# EasyEDA Pro project RBCTL1V2_V1.3.eprj, schematic ctl1v2sch
Board Name: Board1ctl1v2; Create Date: 2024-11-13; Page Name: P1; Project Name: RBCTL1V2; Schematic Name: ctl1v2sch; Update Date: 2024-11-17; Company: 嘉立创EDA; Page Size: A4; Version: V1.0
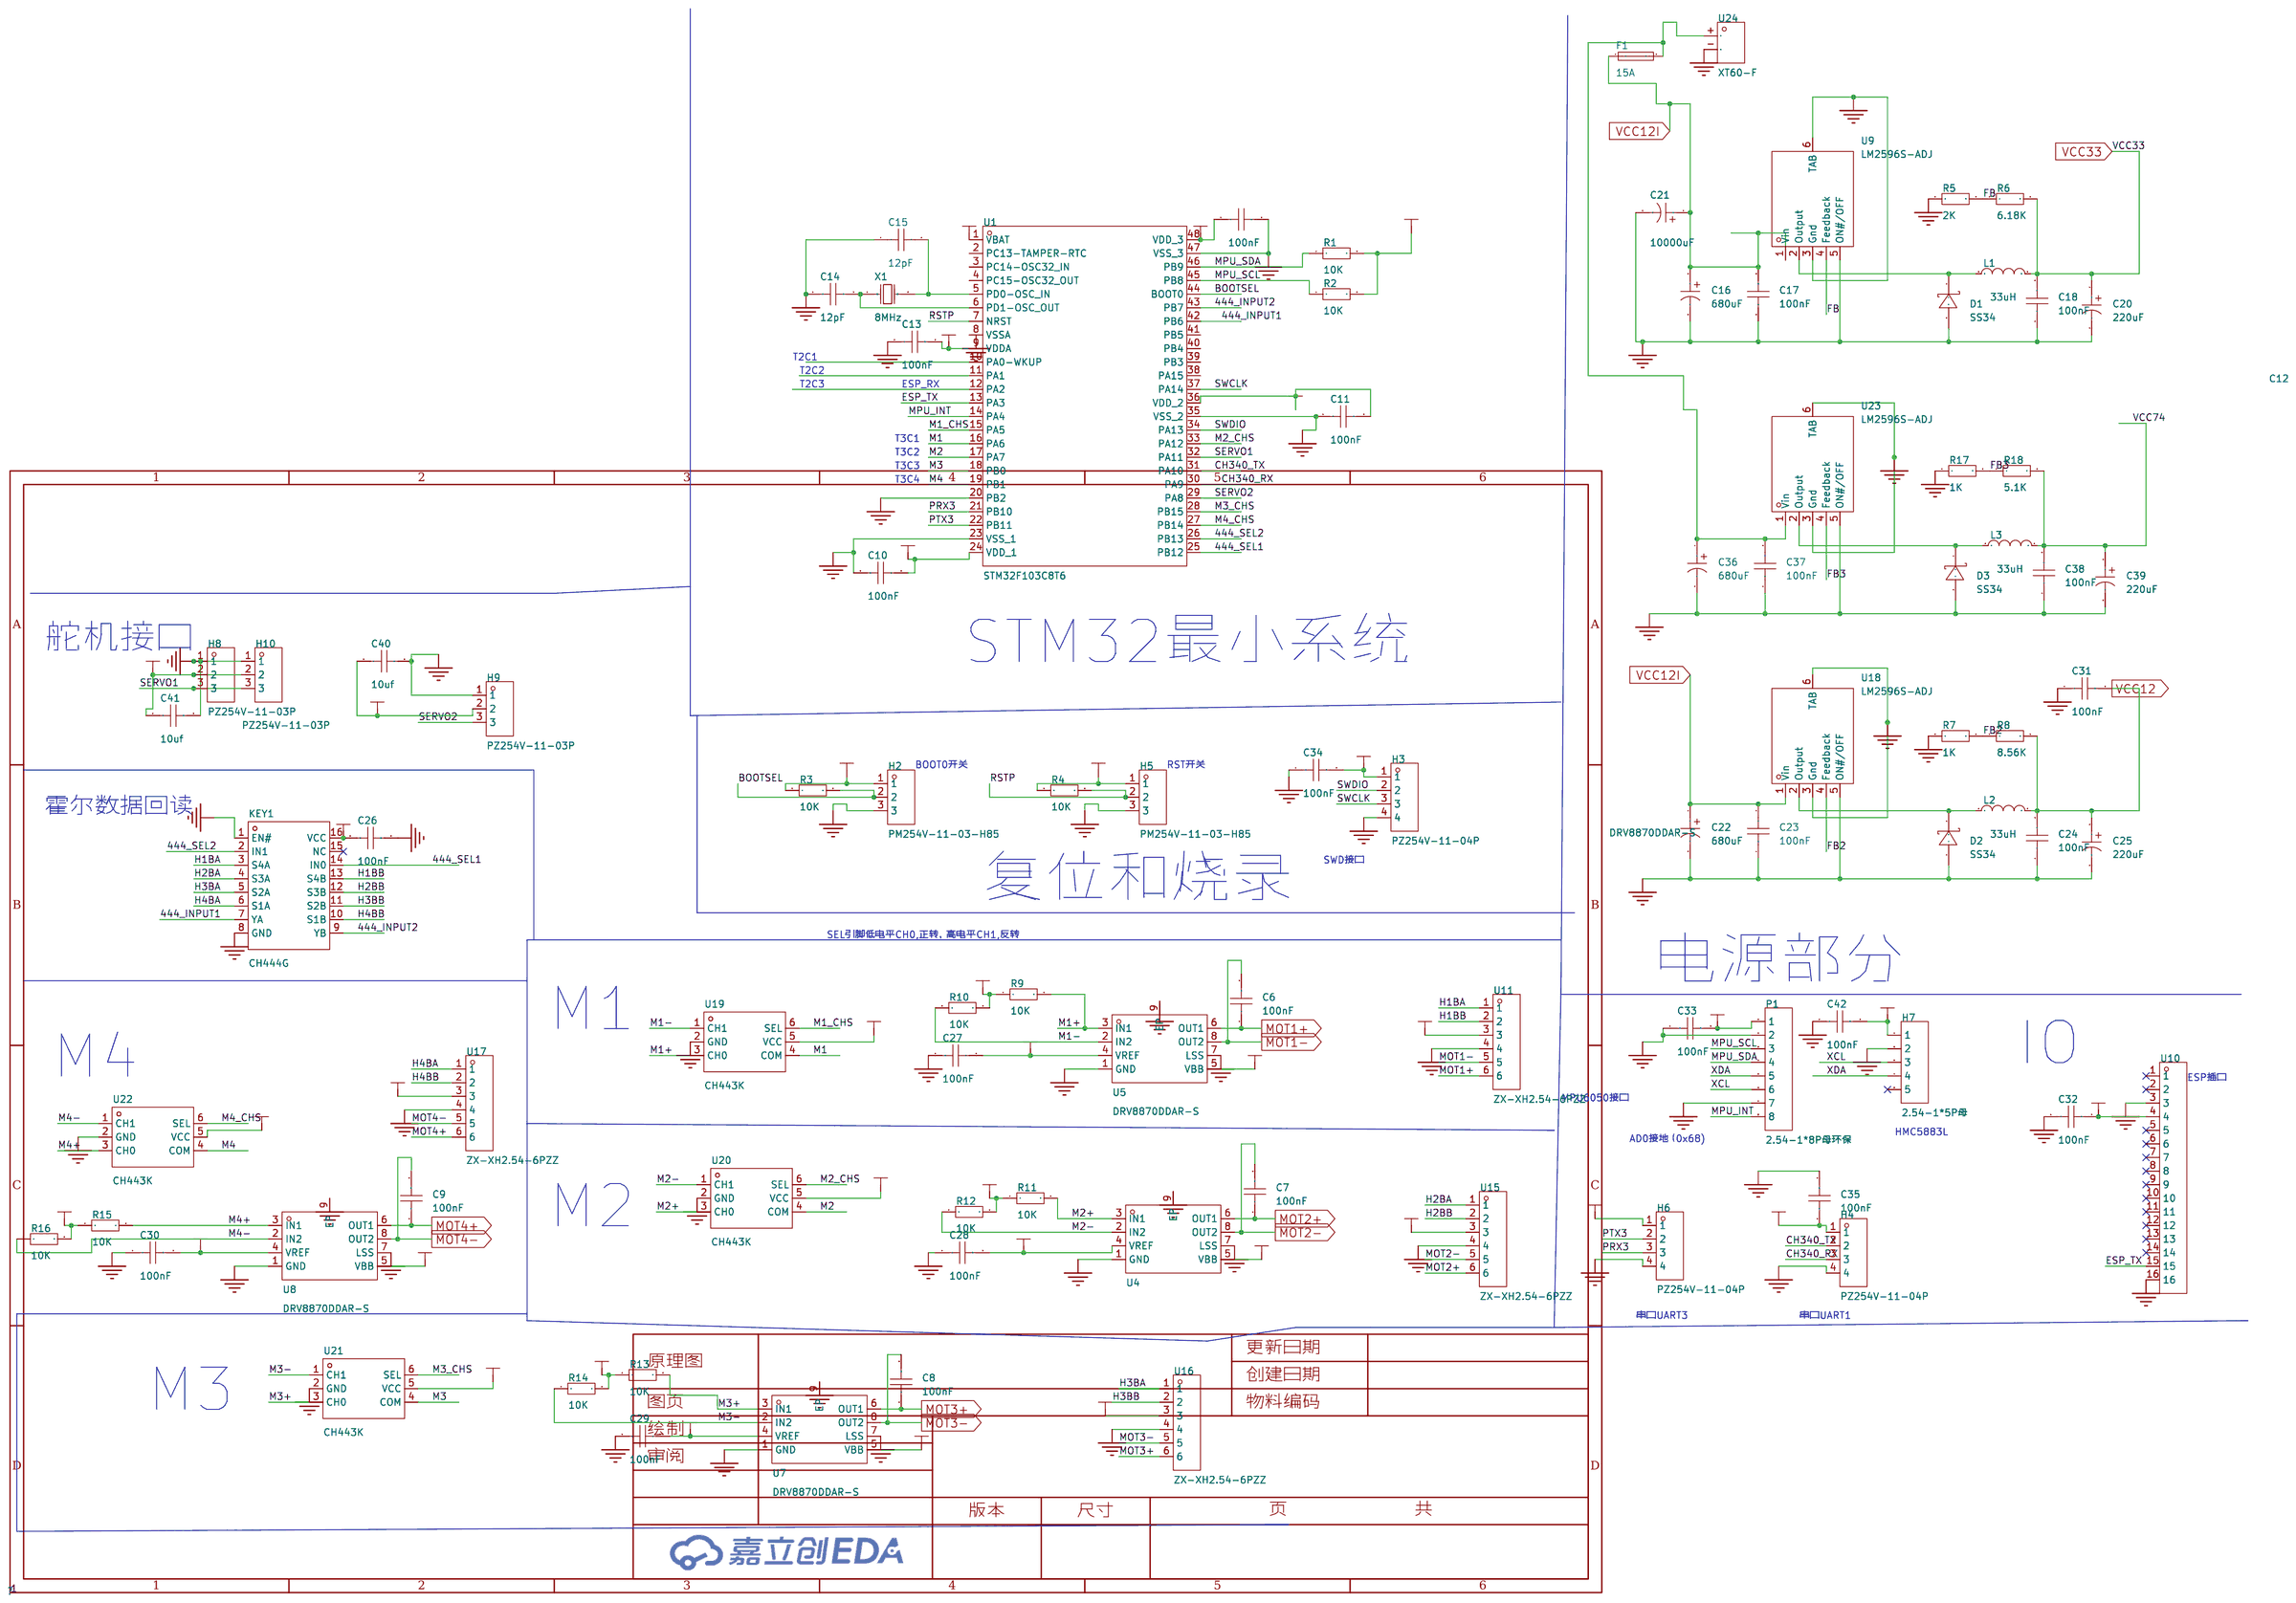
[diagram p0: schematic sheet]

## Parts
C6  100nF  [C0603]
C7  100nF  [C0603]
C8  100nF  [C0603]
C9  100nF  [C0603]
C10  100nF  [C0603]
C11  100nF  [C0603]
C12  100nF  [C0603]
C13  100nF  [C0603]
C14  12pF  [C0603]
C15  12pF  [C0603]
C16  680uF  [CAP-SMD_BD10.0-L10.3-W10.3-LS10.9-FD]
C17  100nF  [C0603]
C18  100nF  [C0603]
C20  220uF  [CAP-SMD_BD10.0-L10.3-W10.3-LS10.9-FD]
C21  10000uF  [CAP-TH_BD18.0-P7.50-D0.8-FD]
C22  680uF  [CAP-SMD_BD10.0-L10.3-W10.3-LS10.9-FD]
C23  100nF  [C0603]
C24  100nF  [C0603]
C25  220uF  [CAP-SMD_BD10.0-L10.3-W10.3-LS10.9-FD]
C26  100nF  [C0603]
C27  100nF  [C0603]
C28  100nF  [C0603]
C29  100nF  [C0603]
C30  100nF  [C0603]
C31  100nF  [C0603]
C32  100nF  [C0603]
C33  100nF  [C0603]
C34  100nF  [C0603]
C35  100nF  [C0603]
C36  680uF  [CAP-TH_BD10.0-P5.00-D0.6-FD]
C37  100nF  [C1206]
C38  100nF  [C0603]
C39  220uF  [CAP-SMD_BD10.0-L10.3-W10.3-LS10.9-FD]
C40  10uf  [C0603]
C41  10uf  [C0603]
C42  100nF  [C0603]
D1  SS34  [SMA_L4.3-W2.6-LS5.2-RD]
D2  SS34  [SMA_L4.3-W2.6-LS5.2-RD]
D3  SS34  [SMA_L4.3-W2.6-LS5.2-RD]
F1  15A  [F1812]
H2  PM254V-11-03-H85  [HDR-TH_3P-P2.54-V-F]
H3  PZ254V-11-04P  [HDR-TH_4P-P2.54-V-M]
H4  PZ254V-11-04P  [HDR-TH_4P-P2.54-V-M]
H5  PM254V-11-03-H85  [HDR-TH_3P-P2.54-V-F]
H6  PZ254V-11-04P  [HDR-TH_4P-P2.54-V-M]
H7  2.54-1*5P母  [HDR-TH_5P-P2.54-V-F]
H8  PZ254V-11-03P  [HDR-TH_3P-P2.54-V-M]
H9  PZ254V-11-03P  [HDR-TH_3P-P2.54-V-M]
H10  PZ254V-11-03P  [HDR-TH_3P-P2.54-V-M]
KEY1  CH444G  [SOP-16_L10.0-W3.9-P1.27-LS6.0-BL]
L1  33uH  [IND-SMD_L7.0-W6.6_FXL0630]
L2  33uH  [IND-SMD_L7.0-W6.6_FXL0630]
L3  33uH  [IND-SMD_L7.0-W6.6_FXL0630]
P1  2.54-1*8P母环保  [HDR-TH_8P-P2.54-V-F-1]
R1  10K  [R0805]
R2  10K  [R0805]
R3  10K  [R0805]
R4  10K  [R0805]
R5  2K  [R0603]
R6  6.18K  [R0603]
R7  1K  [R0603]
R8  8.56K  [R0603]
R9  10K  [R0603]
R10  10K  [R0603]
R11  10K  [R0603]
R12  10K  [R0603]
R13  10K  [R0603]
R14  10K  [R0603]
R15  10K  [R0603]
R16  10K  [R0603]
R17  1K  [R0603]
R18  5.1K  [R0603]
U1  STM32F103C8T6  [LQFP-48_L7.0-W7.0-P0.50-LS9.0-BL]
U4  DRV8870DDAR-S  [SOP-8_L4.9-W3.9-P1.27-LS6.0-BL-EP3.3-2]
U5  DRV8870DDAR-S  [SOP-8_L4.9-W3.9-P1.27-LS6.0-BL-EP3.3-2]
U7  DRV8870DDAR-S  [SOP-8_L4.9-W3.9-P1.27-LS6.0-BL-EP3.3-2]
U8  DRV8870DDAR-S  [SOP-8_L4.9-W3.9-P1.27-LS6.0-BL-EP3.3-2]
U9  LM2596S-ADJ  [TO-263-5_L10.2-W8.6-P1.70-LS14.4-BL]
U10  PM254-1-16-Z-8.5  [HDR-TH_16P-P2.54-V-F-A]
U11  ZX-XH2.54-6PZZ  [CONN-TH_6P-P2.50_ZX-XH2.54-6PZZ]
U15  ZX-XH2.54-6PZZ  [CONN-TH_6P-P2.50_ZX-XH2.54-6PZZ]
U16  ZX-XH2.54-6PZZ  [CONN-TH_6P-P2.50_ZX-XH2.54-6PZZ]
U17  ZX-XH2.54-6PZZ  [CONN-TH_6P-P2.50_ZX-XH2.54-6PZZ]
U18  LM2596S-ADJ  [TO-263-5_L10.2-W8.6-P1.70-LS14.4-BL]
U19  CH443K  [SC70-6_L2.1-W1.3-P0.65-LS2.3-BL]
U20  CH443K  [SC70-6_L2.1-W1.3-P0.65-LS2.3-BL]
U21  CH443K  [SC70-6_L2.1-W1.3-P0.65-LS2.3-BL]
U22  CH443K  [SC70-6_L2.1-W1.3-P0.65-LS2.3-BL]
U23  LM2596S-ADJ  [TO-263-5_L10.2-W8.6-P1.70-LS14.4-BL]
U24  XT60-F  [CONN-TH_XT60PB-F]
X1  8MHz  [CRYSTAL-SMD_L11.5-W4.8-LS12.7]

## Library data of the parts
C6-C15 C17 C18 C23 C24 C26-C35 C38 C40-C42 = CAP_0603: Supplier Footprint: 0603
C16 C22 = GVM1V681M1010: LCSC Part Name: 680uF ±20% 35V; Supplier Part: C2980172; Manufacturer: HONOR(荣誉); Supplier Footprint: SMD,D12.5xL13.5mm; JLCPCB Part Class: 扩展库; Datasheet: https://atta.szlcsc.com/upload/public/pdf/source/20220509/EB2A569F0F3393644DE07704993C28AA.pdf; Supplier: LCSC; Tolerance: ±20%; Rated Voltage: 35V; Ripple Current: 1.19A@120Hz; Equivalent Series Resistance(ESR): 60mΩ@120Hz; φD: 10mm; L: 10.2mm; Lifetime @ Temp: 5000hrs@105℃; Operating Temperature: -55℃~+105℃
C20 C25 C39 = GVM1V681M1010: LCSC Part Name: 680uF ±20% 35V; Supplier Part: C2980172; Manufacturer: HONOR(荣誉); Supplier Footprint: SMD,D10xL10.5mm; JLCPCB Part Class: 扩展库; Datasheet: https://atta.szlcsc.com/upload/public/pdf/source/20220509/EB2A569F0F3393644DE07704993C28AA.pdf; Supplier: LCSC; Tolerance: ±20%; Rated Voltage: 35V; Ripple Current: 1.19A@120Hz; Equivalent Series Resistance(ESR): 60mΩ@120Hz; φD: 10mm; L: 10.2mm; Lifetime @ Temp: 5000hrs@105℃; Operating Temperature: -55℃~+105℃
C21 = ERE1EM103M40OT: LCSC Part Name: 10000uF ±20% 25V; Supplier Part: C724478; Manufacturer: AISHI(艾华集团); Supplier Footprint: 插件,D18xL40mm; JLCPCB Part Class: 扩展库; Datasheet: https://atta.szlcsc.com/upload/public/pdf/source/20190702/C401559_D116D2C5ED42D458EC9986A0749FDD04.pdf; Supplier: LCSC; Tolerance: ±20%; Rated Voltage: 25V
C36 = ERS1VM681G16OT: LCSC Part Name: 680uF ±20% 35V; Supplier Part: C721283; Manufacturer: AISHI(艾华集团); Supplier Footprint: 插件,D10xL16mm; JLCPCB Part Class: 扩展库; Datasheet: https://atta.szlcsc.com/upload/public/pdf/source/20191015/C438940_4B8E60A742BB0AE40DDEF87A5C89089D.pdf; Supplier: LCSC; Tolerance: ±20%; Rated Voltage: 35V
C37 = CAP_1206: Supplier Footprint: 1206
D1-D3 = SS34_C8678: LCSC Part Name: 电压:40V 电流:3A; Supplier Part: C8678; Manufacturer: MDD(辰达半导体); Supplier Footprint: SMA(DO-214AC); Datasheet: https://atta.szlcsc.com/upload/public/pdf/source/20240710/2118BB86FDDB2E0B294389AC1F3F65C8.pdf; Supplier: LCSC; Diode Configuration: 独立式; Forward Voltage (Vf@If): 550mV@3A; Reverse Voltage (Vr): 40V; Rectified Current: 3A; Reverse Leakage Current (Ir): 500uA@40V
F1 = JK-MSMD050-30: LCSC Part Name: 贴片保险丝 1812 0.5A 30V 自恢复保险丝; Supplier Part: C369168; Manufacturer: JK(金科); Supplier Footprint: 1812; JLCPCB Part Class: Extended Part; Datasheet: https://atta.szlcsc.com/upload/public/pdf/source/20190306/C369168_666AD8DA49E842FD6D0EBD7C2E7BAC74.pdf; Supplier: LCSC; Operating Voltage (Max): 30V; Current Rating (Max): 100A; Hold Current: 500mA; Trip Current: 1A; Maximum Time to Trip: 150ms
H2 H5 = PM254V-11-03-H85: LCSC Part Name: 间距:2.54mm 1x3P 直插; Supplier Part: C541850; Manufacturer: XFCN(兴飞); Supplier Footprint: 插件,P=2.54mm; JLCPCB Part Class: 扩展库; Datasheet: https://atta.szlcsc.com/upload/public/pdf/source/20200518/C541849_85853D71FC67C51915A806977A588FDA.pdf; Supplier: LCSC; Holes Structure: 1x3P; Pitch: 2.54mm; Mounting Type: 直插; Number of Rows: 单排; Number of Holes: 3P; Contact Material: 黄铜
H3 H4 H6 = PZ254V-11-04P: LCSC Part Name: 间距:2.54mm 1x4P 直插 方针; Supplier Part: C2691448; Manufacturer: XFCN(兴飞); Supplier Footprint: 插件,P=2.54mm; JLCPCB Part Class: 扩展库; Datasheet: https://atta.szlcsc.com/upload/public/pdf/source/20200309/C492403_F9F19131791D08044AD4F84F8E751A34.pdf; Supplier: LCSC; Pin Structure: 1x4P; Pitch: 2.54mm; Circluar Pins/Square Pins: 方针; Mounting Type: 直插; Number of Rows: 单排; Number of Pins: 4P; Current Rating (Max): 3A; Voltage Rating (Max): 250V; Length of Mating Pin: 6mm; Insulation Height: 2.5mm; Length of End Connection Pin: 3mm; Operating Temperature Range: -40℃~+105℃; Color: 黑色
H7 = 2.54-1*5P母: LCSC Part Name: 间距:2.54mm 1x5P 直插; Supplier Part: C50950; Manufacturer: BOOMELE(博穆精密); Supplier Footprint: 插件,P=2.54mm; JLCPCB Part Class: 扩展库; Datasheet: https://atta.szlcsc.com/upload/public/pdf/source/20210301/C2718488_F4427B881E42CAA8DDB0B1C12B3A522C.pdf; Supplier: LCSC; Holes Structure: 1x5P; Pitch: 2.54mm; Mounting Type: 直插; Number of Rows: 单排; Number of Holes: 5P
H8-H10 = PZ254V-11-03P: LCSC Part Name: 间距:2.54mm 1x3P 直插 方针; Supplier Part: C2937625; Manufacturer: XFCN(兴飞); Supplier Footprint: 插件,P=2.54mm; JLCPCB Part Class: 扩展库; Datasheet: https://atta.szlcsc.com/upload/public/pdf/source/20200309/C492402_8335C3D49C4E4C618838D59BB1D024C1.pdf; Supplier: LCSC; Pin Structure: 1x3P; Pitch: 2.54mm; Circluar Pins/Square Pins: 方针; Mounting Type: 直插; Number of Rows: 单排; Number of Pins: 3P; Current Rating (Max): 3A; Voltage Rating (Max): 250V; Length of Mating Pin: 6mm; Insulation Height: 2.5mm; Length of End Connection Pin: 3mm; Operating Temperature Range: -40℃~+105℃; Color: 黑色
KEY1 = CH444G: Supplier Part: C86413; Manufacturer: WCH(南京沁恒); Supplier Footprint: SOP-16; JLCPCB Part Class: 扩展库; Datasheet: https://atta.szlcsc.com/upload/public/pdf/source/20200819/C86413_4A848764FF9BBB5607D598F0D5C44A3B.pdf; Supplier: LCSC
L1-L3 = FXL0630-470-M: LCSC Part Name: 47uH ±20% 2A; Supplier Part: C475913; Manufacturer: cjiang(长江微电); Supplier Footprint: SMD,6.6x7mm; JLCPCB Part Class: 扩展库; Datasheet: https://atta.szlcsc.com/upload/public/pdf/source/20240426/3189EA8206330E2108542F9E34E540E7.pdf; Supplier: LCSC; Tolerance: ±20%; Rated Current: 1.5A; Saturation Current (Isat): 2A; DC Resistance (DCR): 385mΩ; Type: 一体成型电感
P1 = 2.54-1*8P母环保: LCSC Part Name: 间距:2.54mm 1x8P 直插; Supplier Part: C27438; Manufacturer: BOOMELE(博穆精密); Supplier Footprint: 插件,P=2.54mm; JLCPCB Part Class: 扩展库; Datasheet: https://atta.szlcsc.com/upload/public/pdf/source/20231221/1CA800C6799ED97958773716FAA1BFFE.pdf; Supplier: LCSC; Holes Structure: 1x8P; Pitch: 2.54mm; Mounting Type: 直插; Number of Rows: 单排; Number of Holes: 8P
R1-R4 = Res_0805: Supplier Footprint: 0805
R5-R18 = Res_0603: Supplier Footprint: 0603
U1 = STM32F103C8T6: LCSC Part Name: 主流增强型ARM Cortex-M3 MCU，具有64 KB Flash、72 MHz CPU、电机控制、USB和CAN; Supplier Part: C8734; Manufacturer: ST(意法半导体); Supplier Footprint: LQFP-48(7x7); JLCPCB Part Class: 扩展库; Datasheet: https://atta.szlcsc.com/upload/public/pdf/source/20220812/8363ACEC51AD55ECEB84799464F7CB85.pdf; Supplier: LCSC; CPU Core: ARM-M3; Program Storage Size: 64KB; RAM Size: 20KB; GPIO Ports Number: 37; Operating Voltage Range: 2V~3.6V; CPU Maximum Speed: 72MHz; Program Memory Type: FLASH; Operating Temperature Range: -40℃~+85℃; ADC (Bit): 12bit; Universal Serial Bus: 有; Peripheral/Function: 看门狗；DMA；看门狗；温度传感器; Watchdog: 有; Infrared Data Association: 有; Low-Voltage Detect: 有; Direct Memory Access: 有; Internal Oscillator: 有
U4 U5 U7 U8 = DRV8870DDAR-S: LCSC Part Name: 5.0A峰值驱动输出,3.5A持续输出 有刷直流电机驱动芯片 40V; Supplier Part: C19077371; Manufacturer: JSMSEMI(杰盛微); Supplier Footprint: SOP-8; JLCPCB Part Class: 扩展库; Datasheet: https://atta.szlcsc.com/upload/public/pdf/source/20240827/9826A71A2D9AFC463D56CB5155EA76F8.pdf; Supplier: LCSC; Supply Voltage: 8V~40V; Output Current: 3A; RDS(on): 500mΩ; Peak Current: 5A
U9 U18 U23 = LM2596S-ADJ: Supplier Part: C10000; Supplier Footprint: TO-263-5(DDPAK); JLCPCB Part Class: 扩展库; Supplier: LCSC; Function: 降压型; Input Voltage: 4.5V~40V; Output Current (Max): 3A; Switching Frequency: 150kHz; Synchronous Rectification: 否; Number of Outputs: 1; Topology: 降压式
U10 = PM254-1-16-Z-8.5: LCSC Part Name: 1x16P 间距:2.54mm 直插; Supplier Part: C2897379; Manufacturer: HCTL(华灿天禄); Supplier Footprint: 插件,P=2.54mm; JLCPCB Part Class: 扩展库; Datasheet: https://atta.szlcsc.com/upload/public/pdf/source/20230609/534BE42964C679BDE98E061007C4ABD6.pdf; Supplier: LCSC; Holes Structure: 1x16P; Pitch: 2.54mm; Circular Hole / Square Hole: 方孔; Mounting Type: 直插; Number of Rows: 单排; Number of Holes: 16P; Current Rating (Max): 3A; Holes Direction: 顶部; Insulation Height: 8.5mm; Contact Material: 铜合金; Operating Temperature Range: -40℃~+105℃; Soldering Temperature(Max): 260℃@5S
U11 U15-U17 = ZX-XH2.54-6PZZ: Supplier Part: C7429636; Manufacturer: Megastar(兆星); Supplier Footprint: 插件,P=2.54mm; JLCPCB Part Class: 扩展库; Datasheet: https://atta.szlcsc.com/upload/public/pdf/source/20230619/1243AD0A516E39CD3D274D8985780568.pdf; Supplier: LCSC; Pins Structure: 1x6P; Pitch: 2.54mm; Mounting Style: 直插; Reference Series: XH; Number of Pins: 6P; Number of Rows: 1; Number of PINs Per Row: 6; Current Rating (Max): 3A; Contact Material: 黄铜; Contact Plating: 锡; Operating Temperature Range: -25℃~+85℃
U19-U22 = CH443K: LCSC Part Name: 1单刀双掷5V低阻模拟开关芯片; Supplier Part: C125185; Manufacturer: WCH(南京沁恒); Supplier Footprint: SC-70-6(SOT-363); JLCPCB Part Class: 扩展库; Datasheet: https://atta.szlcsc.com/upload/public/pdf/source/20200819/C125185_598679904862E814E7C3CDA2CBF564BC.pdf; Supplier: LCSC
U24 = XT60-F: LCSC Part Name: AMASS(艾迈斯)XT60模型插头 3.5mm镀金香蕉头母头 XT60-F; Supplier Part: C98734; Manufacturer: AMASS(艾迈斯); JLCPCB Part Class: 扩展库; Datasheet: https://atta.szlcsc.com/upload/public/pdf/source/20170606/1496716532533.pdf; Supplier: LCSC; Brand: 艾迈斯; Type: 香蕉头; Colour: 黄色; InterfaceType: 母头; MetalMaterial: 镀金
X1 = X49SM8MSD2SC: LCSC Part Name: 8MHz ±20ppm 20pF; Supplier Part: C12674; Manufacturer: YXC(扬兴晶振); Supplier Footprint: HC-49S-SMD; Datasheet: https://atta.szlcsc.com/upload/public/pdf/source/20240329/3EBF42EBCAB50CA65B6FA9D7CFA1955A.pdf; Supplier: LCSC; Crystal Type: 贴片晶振; Normal temperature Frequency Tolerance: ±20ppm; External load capacitor: 20pF; Frequency Stability(Full temperature range): ±30ppm; Operating Temperature: -20℃~+70℃

## Nets
GND: C10.1 C11.1 C12.2 C13.1 C14.1 C15.1 C16.2 C17.1 C18.1 C20.2 C21.2 C22.2 C23.1 C24.1 C25.2 C26.2 C27.1 C28.1 C29.1 C30.1 C31.1 C32.1 C33.1 C34.1 C35.2 C36.2 C37.1 C38.1 C39.2 C40.2 C41.2 C42.1 D1.2(A) D2.2(A) D3.2(A) H2.3 H3.4 H4.4 H5.3 H6.4 H7.2 H8.1 H9.1 H10.1 KEY1.1(EN#) KEY1.8(GND) P1.2 P1.7 R5.1 R7.1 R17.1 U1.8(VSSA) U1.20(PB2) U1.23(VSS_1) U1.35(VSS_2) U1.47(VSS_3) U4.1(GND) U4.7(LSS) U4.9(EP) U5.1(GND) U5.7(LSS) U5.9(EP) U7.1(GND) U7.7(LSS) U7.9(EP) U8.1(GND) U8.7(LSS) U8.9(EP) U9.3(Gnd) U9.5(ON#/OFF) U9.6(TAB) U10.3 U10.16 U11.4 U15.4 U16.4 U17.4 U18.3(Gnd) U18.5(ON#/OFF) U18.6(TAB) U19.2(GND) U20.2(GND) U21.2(GND) U22.2(GND) U23.3(Gnd) U23.5(ON#/OFF) U23.6(TAB) U24.-(2)
VCC12: C24.2 C25.1 C31.2 L2.2 R8.2
VCC12I: C16.1 C17.2 C21.1 C22.1 C23.2 F1.1 U4.5(VBB) U5.5(VBB) U7.5(VBB) U8.5(VBB) U9.1(Vin) U18.1(Vin)
VCC33: C10.2 C11.2 C12.1 C13.2 C18.2 C20.1 C26.1 C27.2 C28.2 C29.2 C30.2 C32.2 C33.2 C34.2 C35.1 C42.2 H2.1 H3.1 H4.1 H5.1 H6.1 H7.1 KEY1.16(VCC) L1.2 P1.1 R1.2 R2.2 R3.1 R4.1 R6.2 R9.1 R10.2 R11.1 R12.2 R13.1 R14.2 R15.1 R16.2 U1.1(VBAT) U1.9(VDDA) U1.24(VDD_1) U1.36(VDD_2) U1.48(VDD_3) U4.4(VREF) U5.4(VREF) U7.4(VREF) U8.4(VREF) U10.4 U11.3 U15.3 U16.3 U17.3 U19.5(VCC) U20.5(VCC) U21.5(VCC) U22.5(VCC)
VCC74: C38.2 C39.1 C40.1 C41.1 H8.2 H9.2 H10.2 L3.2 R18.2
444_INPUT1: KEY1.7(YA) U1.42(PB6)
444_INPUT2: KEY1.9(YB) U1.43(PB7)
444_SEL1: KEY1.14(IN0) U1.25(PB12)
444_SEL2: KEY1.2(IN1) U1.26(PB13)
BOOTSEL: H2.2 R3.2 U1.44(BOOT0)
CH340_RX: H4.3 U1.30(PA9)
CH340_TX: H4.2 U1.31(PA10)
ESP_TX: U1.13(PA3) U10.15
FB: R5.2 R6.1 U9.4(Feedback)
FB2: R7.2 R8.1 U18.4(Feedback)
FB3: R17.2 R18.1 U23.4(Feedback)
H1BA: KEY1.3(S4A) U11.1
H1BB: KEY1.13(S4B) U11.2
H2BA: KEY1.4(S3A) U15.1
H2BB: KEY1.12(S3B) U15.2
H3BA: KEY1.5(S2A) U16.1
H3BB: KEY1.11(S2B) U16.2
H4BA: KEY1.6(S1A) U17.1
H4BB: KEY1.10(S1B) U17.2
M1: U1.16(PA6) U19.4(COM)
M1+: R9.2 U5.3(IN1) U19.3(CH0)
M1-: R10.1 U5.2(IN2) U19.1(CH1)
M1_CHS: U1.15(PA5) U19.6(SEL)
M2: U1.17(PA7) U20.4(COM)
M2+: R11.2 U4.3(IN1) U20.3(CH0)
M2-: R12.1 U4.2(IN2) U20.1(CH1)
M2_CHS: U1.33(PA12) U20.6(SEL)
M3: U1.18(PB0) U21.4(COM)
M3+: R13.2 U7.3(IN1) U21.3(CH0)
M3-: R14.1 U7.2(IN2) U21.1(CH1)
M3_CHS: U1.28(PB15) U21.6(SEL)
M4: U1.19(PB1) U22.4(COM)
M4+: R15.2 U8.3(IN1) U22.3(CH0)
M4-: R16.1 U8.2(IN2) U22.1(CH1)
M4_CHS: U1.27(PB14) U22.6(SEL)
MOT1+: C6.1 U5.6(OUT1) U11.6
MOT1-: C6.2 U5.8(OUT2) U11.5
MOT2+: C7.1 U4.6(OUT1) U15.6
MOT2-: C7.2 U4.8(OUT2) U15.5
MOT3+: C8.1 U7.6(OUT1) U16.6
MOT3-: C8.2 U7.8(OUT2) U16.5
MOT4+: C9.1 U8.6(OUT1) U17.6
MOT4-: C9.2 U8.8(OUT2) U17.5
MPU_INT: P1.8 U1.14(PA4)
MPU_SCL: P1.3 R2.1 U1.45(PB8)
MPU_SDA: P1.4 R1.1 U1.46(PB9)
PRX3: H6.3 U1.21(PB10)
PTX3: H6.2 U1.22(PB11)
RSTP: H5.2 R4.2 U1.7(NRST)
SERVO1: H8.3 H10.3 U1.32(PA11)
SERVO2: H9.3 U1.29(PA8)
SWCLK: H3.3 U1.37(PA14)
SWDIO: H3.2 U1.34(PA13)
XCL: H7.3 P1.6
XDA: H7.4 P1.5
$2N1258: C15.2 U1.5(PD0-OSC_IN) X1.2(OSC2)
$2N1262: C14.2 U1.6(PD1-OSC_OUT) X1.1(OSC1)
$2N7414: D1.1(K) L1.1 U9.2(Output)
$2N13978: D2.1(K) L2.1 U18.2(Output)
$2N27693: D3.1(K) L3.1 U23.2(Output)
$2N41129: C36.1 C37.2 F1.2 U23.1(Vin) U24.+(1)

Not connected (* = marked no-connect by the designer): H7 5*; KEY1 15(NC)*; U1 2(PC13-TAMPER-RTC) 3(PC14-OSC32_IN) 4(PC15-OSC32_OUT) 10(PA0-WKUP) 11(PA1) 12(PA2) 38(PA15) 39(PB3) 40(PB4) 41(PB5); U10 1* 2* 5* 6* 7* 8* 9* 10* 11* 12* 13* 14*

## Notes on the sheet
- T2C1
- T2C2
- T2C3
- ESP_RX
- T3C1
- T3C2
- T3C3
- T3C4
- 舵机接口
- STM32最小系统
- BOOT0开关
- RST开关
- 霍尔数据回读
- SWD接口
- 复位和烧录
- SEL引脚低电平CH0,正转，高电平CH1,反转
- 电源部分
- M1
- IO
- M4
- ESP插口
- MPU6050接口
- HMC5883L
- AD0接地（0x68)
- M2
- 串口UART3
- 串口UART1
- M3
